# Altium project ESP32 with cam_OV5640_v2.PrjPcb
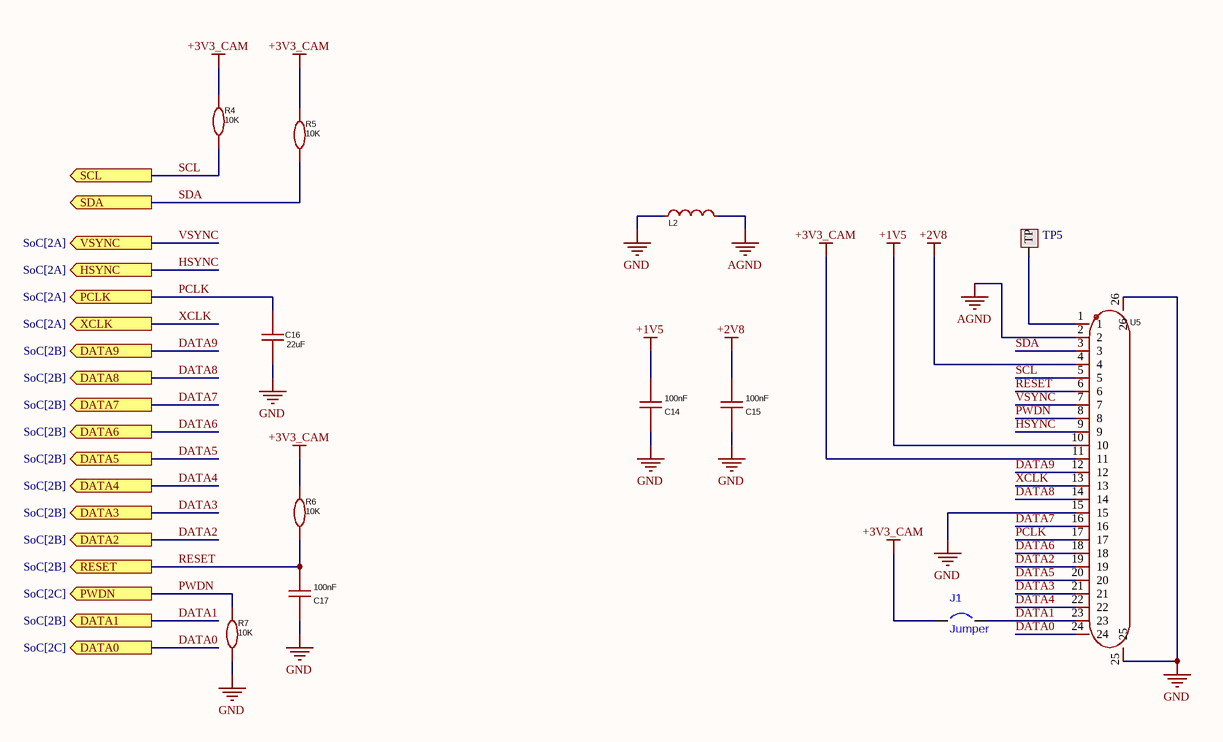
[diagram p0: Camera.SchDoc]
4 sheets, 53 parts. Net scope: flat (ports and power ports of the same name join across sheets).
Board file: ESP32 wth OV5640 CAM.PcbDoc
Sheets:
  Camera.SchDoc
  Power Conversion.SchDoc
  Project Overview.SchDoc
  SoC.SchDoc

## Sheet Camera.SchDoc
size A4; SheetNumber: 1; SheetTotal: 4

### Parts
C14  100nF  [100nF SMD Ceramic 201]
C15  100nF  [100nF SMD Ceramic 201]
C16  22uF  [22uF SMD Ceramic 1210]
C17  100nF  [100nF SMD Ceramic 201]
J1  Jumper  [PAD-JUMPER-2]
L2  BLM15AG601SN1D  [Ferrite]  (value not drawn)
R4  10K  [10K SMD Ceramic 201]
R5  10K  [10K SMD Ceramic 201]
R6  10K  [10K SMD Ceramic 201]
R7  10K  [10K SMD Ceramic 201]
TP5  TEST POINT  [TESTPOINT]  (value not drawn)
U5  FPC-05FB-24PH20  [Camera Connector]  (value not drawn)

### Ports
DATA0 (out, see SoC[2C]), DATA1 (out, see SoC[2B]), DATA2 (out, see SoC[2B]), DATA3 (out, see SoC[2B]), DATA4 (out, see SoC[2B]), DATA5 (out, see SoC[2B]), DATA6 (out, see SoC[2B]), DATA7 (out, see SoC[2B]), DATA8 (out, see SoC[2B]), DATA9 (out, see SoC[2B]), HSYNC (out, see SoC[2A]), PCLK (out, see SoC[2A]), PWDN (out, see SoC[2C]), RESET (out, see SoC[2B]), SCL (out, see SoC[2A]), SDA (out, see SoC[2A]), VSYNC (out, see SoC[2A]), XCLK (out, see SoC[2A])

### Nets
+1V5: C14.2 U5.10
+2V8: C15.2 U5.4
+3V3_CAM: J1.1 R4.2 R5.2 R6.2 U5.11
AGND: L2.2 U5.2
GND: C14.1 C15.1 C16.1 C17.1 L2.1 R7.1 U5.15 U5.25 U5.26
DATA0: U5.24 ; port DATA0
DATA1: J1.2 U5.23 ; port DATA1
DATA2: U5.19 ; port DATA2
DATA3: U5.21 ; port DATA3
DATA4: U5.22 ; port DATA4
DATA5: U5.20 ; port DATA5
DATA6: U5.18 ; port DATA6
DATA7: U5.16 ; port DATA7
DATA8: U5.14 ; port DATA8
DATA9: U5.12 ; port DATA9
HSYNC: U5.9 ; port HSYNC
PCLK: C16.2 U5.17 ; port PCLK
PWDN: R7.2 U5.8 ; port PWDN
RESET: C17.2 R6.1 U5.6 ; port RESET
SCL: R4.1 U5.5 ; port SCL
SDA: R5.1 U5.3 ; port SDA
VSYNC: U5.7 ; port VSYNC
XCLK: U5.13 ; port XCLK
NetTP5_1: TP5.1(TP) U5.1

### Notes on the sheet
- Date:
- Rev. No.
- Page No.
- Schematic Name
- Designed By
- Omar Faruk Badhon
- Check(1) HW Eng.
- Check(2) SW Eng.
- Approval(1)
- Approval(2)
- Address
- Company
- Dept. Name
- R&D

### Library data of the parts
C14 C15 C17 = 100nF SMD Ceramic 201: 10V 100nF X5R ±10% 0201 Multilayer Ceramic Capacitors MLCC - SMD/SMT ROHS; Manufacturer: muRata(村田); Symbol: GRM033R61A104KE84D; Add into BOM: yes; Device: GRM033R61A104KE84D; LCSC Part Name: 100nF ±10% 10V; Supplier Part: C161466; Manufacturer Part: GRM033R61A104KE84D; Supplier Footprint: 0201; JLCPCB Part Class: Extended Part; Datasheet: https://atta.szlcsc.com/upload/public/pdf/source/20181011/C161466_67687620A192BB2B75972275444AF1E7.pdf; Supplier: LCSC; Convert to PCB: yes; Value: 100nF; Tolerance: ±10%
C16 = 22uF SMD Ceramic 1210: 10V 22uF X7R ±10% 1210 Multilayer Ceramic Capacitors MLCC - SMD/SMT ROHS; Manufacturer: KEMET(基美); Symbol: C1210C226K8RACAUTO; Add into BOM: yes; Device: C1210C226K8RACAUTO; LCSC Part Name: 22uF ±10% 10V; Supplier Part: C561843; Manufacturer Part: C1210C226K8RACAUTO; Supplier Footprint: 1210; JLCPCB Part Class: Extended Part; Datasheet: https://atta.szlcsc.com/upload/public/pdf/source/20200618/C561824_5D581F10239D32C68F7958F74E29471B.pdf; Supplier: LCSC; Convert to PCB: yes; Value: 22uF; Tolerance: ±10%
J1 = JUMPER SOLDER BRIDGE: SMD JUMPER
L2 = BLM15AG601SN1D: 520mΩ ±25% 600Ω@100MHz 0402 Ferrite Beads ROHS; Manufacturer: muRata(村田); Add into BOM: yes; Current Rating: 300mA; Circuits: 1; Symbol: BLM15AG601SN1D; Device: BLM15AG601SN1D; LCSC Part Name: 单路 0402磁珠 阻抗600Ω@100MHz; Supplier Part: C76884; Manufacturer Part: BLM15AG601SN1D; Supplier Footprint: 0402; JLCPCB Part Class: Extended Part; Datasheet: https://atta.szlcsc.com/upload/public/pdf/source/20181120/C333978_3E581FB55966932B05020139ABDE8E01.pdf; Supplier: LCSC; Convert to PCB: yes; Impedance @ Frequency: 600Ω@100MHz; Tolerance: ±25%; DC Resistance: 520mΩ
R4-R7 = 10K SMD Ceramic 201: 50mW Thick Film Resistors 25V ±1% ±200ppm/℃ 10kΩ 0201 Chip Resistor - Surface Mount ROHS; Manufacturer: YAGEO(国巨); Symbol: AF0201FR-0710KL; Add into BOM: yes; Device: AF0201FR-0710KL; LCSC Part Name: 厚膜电阻 10kΩ ±1% 50mW; Supplier Part: C143978; Manufacturer Part: AF0201FR-0710KL; Supplier Footprint: 0201; JLCPCB Part Class: Extended Part; Datasheet: https://atta.szlcsc.com/upload/public/pdf/source/20180927/C229861_4ABDC471507C1ED6AFB4BA66AFC8620A.pdf; Supplier: LCSC; Convert to PCB: yes; Type: Thick Film Resistors; Value: 10kΩ; Tolerance: ±1%; Temperature Coefficient: ±200ppm/℃; Operating Temperature Range: -55℃~+125℃
U5 = Camera Connector: Dual-sided contacts / top and bottom connection -25℃~+85℃ Flip type 0.5mm Horizontal attachment 24P SMD; Manufacturer: XUNPU(讯普); Add into BOM: yes; Locking Feature: Clamshell; FFC, FCB Thickness: 0.3mm; Symbol: FPC-05FB-24PH20; Device: FPC-05FB-24PH20; LCSC Part Name: 间距:0.5mm P数:24P 翻盖式 双侧触点/上下接; Supplier Part: C2856831; Manufacturer Part: FPC-05FB-24PH20; Supplier Footprint: SMD,P=0.5mm,卧贴; JLCPCB Part Class: Extended Part; Datasheet: https://atta.szlcsc.com/upload/public/pdf/source/20210922/C2856831_717985F95873A81D5C0B7E3F2E5E5327.pdf; Supplier: LCSC; Convert to PCB: yes; Contact Type: Double-sided contacts/up and down connection; Number of Contacts: 24P; Pitch: 0.5mm; Mounting Type: 卧贴; Height Above Board: 2mm; Operating Temperature Range: -25℃~+85℃

## Sheet Power Conversion.SchDoc
size A4; SheetNumber: 2; SheetTotal: 4
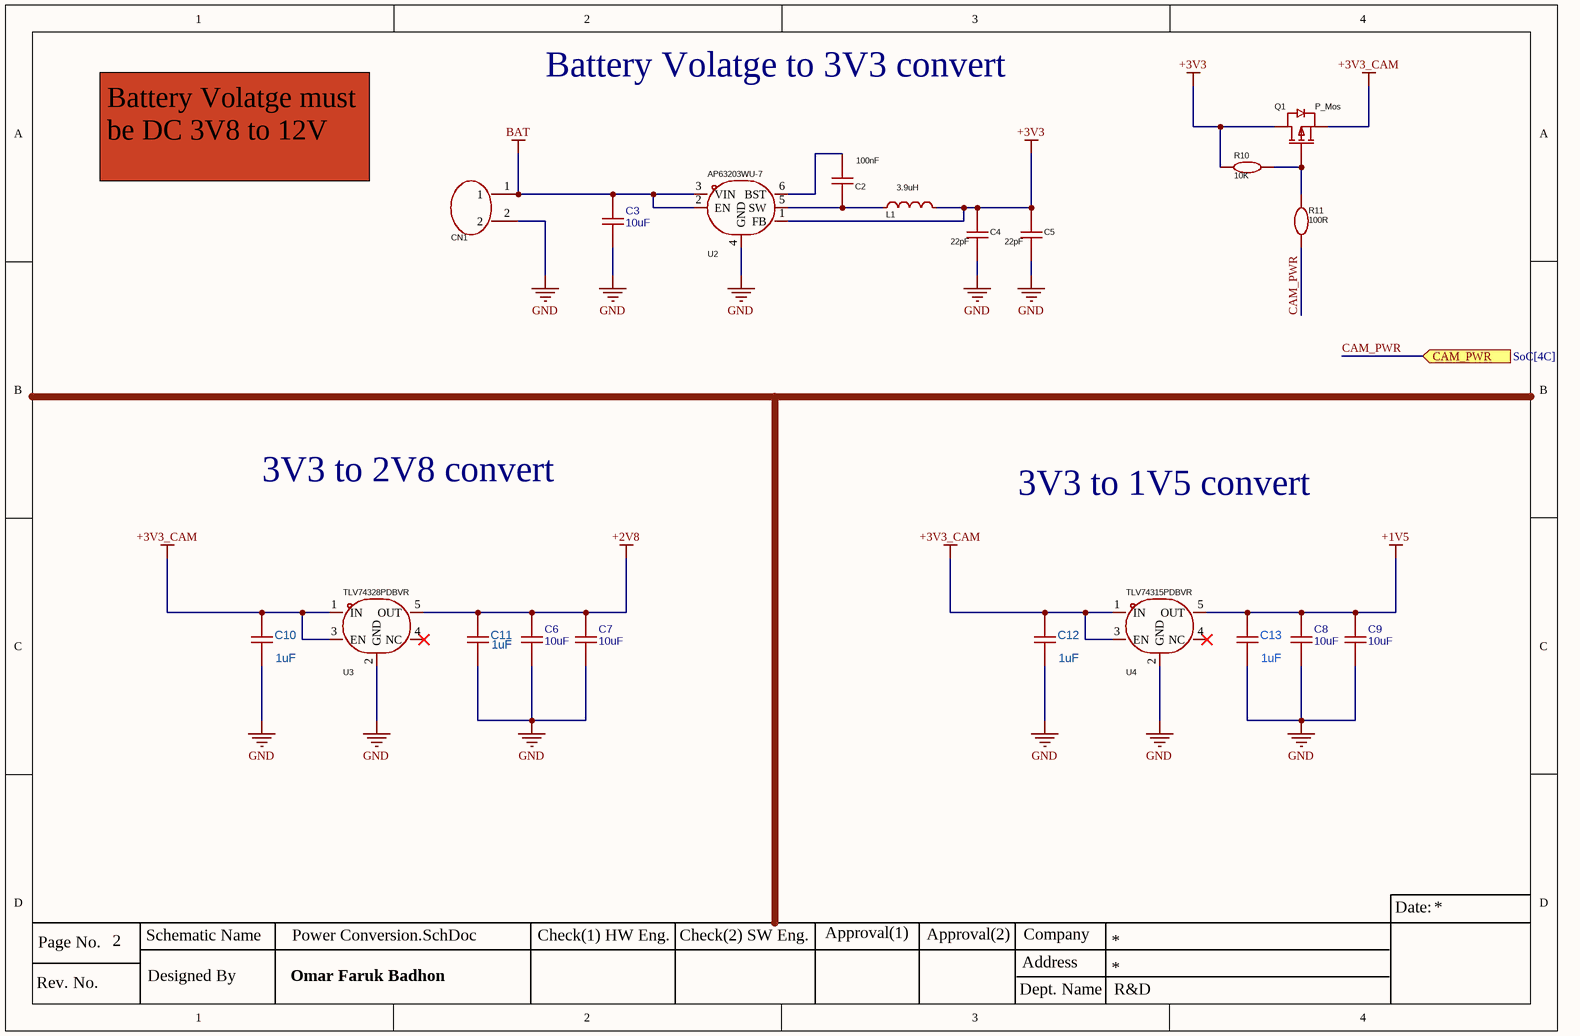
[diagram p1: Power Conversion.SchDoc]

### Parts
C2  100nF  [100nF SMD Ceramic 201]
C3  10uF  [10uF SMD Ceramic 603]
C4  22pF  [22pF SMD Ceramic 603]
C5  22pF  [22pF SMD Ceramic 603]
C6  10uF  [10uF SMD Ceramic 603]
C7  10uF  [10uF SMD Ceramic 603]
C8  10uF  [10uF SMD Ceramic 603]
C9  10uF  [10uF SMD Ceramic 603]
C10  1uF  [1uF Cap]
C11  1uF  [1uF Cap]
C12  1uF  [1uF Cap]
C13  1uF  [1uF Cap]
CN1  B2B-PH-K-S(LF)(SN)  [Connector 2P]  (value not drawn)
L1  3.9uH  [3.9uH power Inductor]
Q1  P_Mos  [P channel msfet (AO3401A1)]
R10  10K  [10K SMD Ceramic 201]
R11  100R  [100R 402]
U2  AP63203WU-7  [3V3 Converter (AP63203)]
U3  TLV74328PDBVR  [2V8 Converter (TLV74328)]
U4  TLV74315PDBVR  [1V5 Converter (TLV74215)]

### Ports
CAM_PWR (in, see SoC[4C])

### Nets
+1V5: C8.2 C9.2 C13.2 U4.5(OUT)
+2V8: C6.2 C7.2 C11.2 U3.5(OUT)
+3V3: C4.2 C5.2 L1.2 Q1.3(D) R10.1 U2.1(FB)
+3V3_CAM: C10.2 C12.2 Q1.2(S) U3.1(IN) U3.3(EN) U4.1(IN) U4.3(EN)
BAT: C3.2 CN1.1 U2.2(EN) U2.3(VIN)
GND: C3.1 C4.1 C5.1 C6.1 C7.1 C8.1 C9.1 C10.1 C11.1 C12.1 C13.1 CN1.2 U2.4(GND) U3.2(GND) U4.2(GND)
CAM_PWR: R11.1 ; port CAM_PWR
NetC2_1: C2.1 L1.1 U2.5(SW)
NetC2_2: C2.2 U2.6(BST)
NetQ1_1: Q1.1(G) R10.2 R11.2

Not connected (* = marked no-connect by the designer): U3 4(NC)*; U4 4(NC)*

### Notes on the sheet
- Battery Volatge to 3V3 convert
- Battery Volatge must be DC 3V8 to 12V
- 3V3 to 2V8 convert
- 3V3 to 1V5 convert
- Date:
- Rev. No.
- Page No.
- Schematic Name
- Designed By
- Omar Faruk Badhon
- Check(1) HW Eng.
- Check(2) SW Eng.
- Approval(1)
- Approval(2)
- Address
- Company
- Dept. Name
- R&D

### Library data of the parts
C2 = 100nF SMD Ceramic 201: as C14 on sheet Camera; Device: GRM033R61A104KE84D; LCSC Part Name: 100nF ±10% 10V; Supplier Part: C161466; Manufacturer Part: GRM033R61A104KE84D; Supplier Footprint: 0201; JLCPCB Part Class: Extended Part; Datasheet: https://atta.szlcsc.com/upload/public/pdf/source/20181011/C161466_67687620A192BB2B75972275444AF1E7.pdf; Supplier: LCSC; Convert to PCB: yes; Value: 100nF; Tolerance: ±10%
C3 C6-C9 = 10uF SMD Ceramic 603: 10V 10uF B ±10% 0603 Multilayer Ceramic Capacitors MLCC - SMD/SMT ROHS; Manufacturer: muRata(村田); Manufacturer Part: GRM188B31A106KE69D; nameAlias: Value; Contributor: LCSC; Supplier: LCSC; Supplier Part: C469532; JLCPCB Part Class: Extended Part; spicePre: C; spiceSymbolName: GRM188B31A106KE69D
C4 C5 = 22pF SMD Ceramic 603: 16V 22pF C0G ±5% 0603 Multilayer Ceramic Capacitors MLCC - SMD/SMT ROHS; Manufacturer: KEMET(基美); Symbol: C0603C220J4GAC7867; Add into BOM: yes; Device: C0603C220J4GAC7867; LCSC Part Name: 22pF ±5% 16V; Supplier Part: C561800; Manufacturer Part: C0603C220J4GAC7867; Supplier Footprint: 0603; JLCPCB Part Class: Extended Part; Datasheet: https://atta.szlcsc.com/upload/public/pdf/source/20200618/C561800_1756A88345AB30E1FCE50DFDDC46141D.pdf; Supplier: LCSC; Convert to PCB: yes; Value: 22pF; Tolerance: ±5%
C10-C13 = 1uF Ceramic SMD 603: 16V 1uF Y5V -20%~+80% 0603 Multilayer Ceramic Capacitors MLCC - SMD/SMT ROHS; Manufacturer: SAMWHA(三和); Symbol: CS1608Y5V105Z160NRB; Add into BOM: yes; Device: CS1608Y5V105Z160NRB; LCSC Part Name: 1uF -20%~+80% 16V; Supplier Part: C5189821; Manufacturer Part: CS1608Y5V105Z160NRB; Supplier Footprint: 0603; JLCPCB Part Class: Extended Part; Datasheet: https://atta.szlcsc.com/upload/public/pdf/source/20221012/139B9393213A50C271C48844AD3DF211.pdf; Supplier: LCSC; Convert to PCB: yes; Value: 1uF; Tolerance: -20%~+80%
CN1 = Connector 2P: 1x2P 2P PH Tin 2 -25℃~+85℃ 2A 1 2mm Brass Direct Insert Plugin,P=2mm Wire To Board Connector ROHS; Manufacturer: JST; Add into BOM: yes; Number of PINs Per Row: 2; Rated Voltage (Max): 100V; Plastic Material: PA66; Flame Retardant Rating: UL94V-0; Supplementary Features: K-leg punch; Z-Height of the Board: 6mm; X-Length of Bottom Edge on Board (Spacing Line): 5.9mm; Y-Width of Bottom Edge on Board: 4.5mm; Symbol: B2B-PH-K-S(LF)(SN); Device: B2B-PH-K-S(LF)(SN); LCSC Part Name: 1x2P 间距:2mm 直插 系列:PH; Supplier Part: C131337; Manufacturer Part: B2B-PH-K-S(LF)(SN); Supplier Footprint: 插件,P=2mm; JLCPCB Part Class: Extended Part; Datasheet: https://atta.szlcsc.com/upload/public/pdf/source/20171026/C131342_15089839687311058815.pdf; Supplier: LCSC; Convert to PCB: yes; Pins Structure: 1x2P; Pitch: 2mm; Mounting Style: Direct Insert; Reference Series: PH; Number of Pins: 2P; Number of Rows: 1; Row Spacing: -; Current Rating (Max): 2A; Contact Material: Brass; Contact Plating: Tin; Operating Temperature Range: -25℃~+85℃; Colour: White
L1 = 3.9uH SMD PI: 1.5A 3.9uH ±20% 1.4A SMD,3x3mm Power Inductors ROHS; Manufacturer: cjiang(长江微电); Symbol: FNR3015S3R9MT; Add into BOM: yes; DC Resistance (DCR): 137mΩ; Device: FNR3015S3R9MT; LCSC Part Name: 3.9uH ±20% 1.4A; Supplier Part: C167751; Manufacturer Part: FNR3015S3R9MT; Supplier Footprint: SMD,3x3mm; JLCPCB Part Class: Extended Part; Datasheet: https://atta.szlcsc.com/upload/public/pdf/source/20190327/C167925_9EFF0AABC4CA629C2CC95961DBF7D39D.pdf; Supplier: LCSC; Convert to PCB: yes; Value: 3.9uH; Tolerance: ±20%; Saturation Current (Isat): 1.4A
Q1 = P channel msfet (AO3401A1): 30V 4A 44mΩ@10V,4.3A 1.4W 1.3V@250uA 1 Piece P-Channel SOT-23 MOSFETs ROHS; Manufacturer: AOS; Device: AO3401A_C15127; Add into BOM: yes; Type: 1个PChannel; Total Gate Charge (Qg@Vgs): 12.2nC@4.5V; Input Capacitance (Ciss@Vds): 1.2nF@15V; Symbol: AO3401A; LCSC Part Name: 1个P沟道 耐压:30V 电流:4A; Supplier Part: C15127; Manufacturer Part: AO3401A; Supplier Footprint: SOT-23; JLCPCB Part Class: Basic Part; Datasheet: https://atta.szlcsc.com/upload/public/pdf/source/20160507/1462613609053.pdf; Supplier: LCSC; Convert to PCB: yes; Drain Source On Resistance (RDS(on)@Vgs,Id): 44mΩ@10V,4.3A; Gate Threshold Voltage (Vgs(th)@Id): 1.3V@250uA; Operating Temperature: -55℃~+150℃@(Tj)
R10 = 10K SMD Ceramic 201: as R4 on sheet Camera; Device: AF0201FR-0710KL; LCSC Part Name: 厚膜电阻 10kΩ ±1% 50mW; Supplier Part: C143978; Manufacturer Part: AF0201FR-0710KL; Supplier Footprint: 0201; JLCPCB Part Class: Extended Part; Datasheet: https://atta.szlcsc.com/upload/public/pdf/source/20180927/C229861_4ABDC471507C1ED6AFB4BA66AFC8620A.pdf; Supplier: LCSC; Convert to PCB: yes; Type: Thick Film Resistors; Value: 10kΩ; Tolerance: ±1%; Temperature Coefficient: ±200ppm/℃; Operating Temperature Range: -55℃~+125℃
R11 = 100R 402: 100mW Thick Film Resistors ±100ppm/℃ ±1% 100Ω 0402 Chip Resistor - Surface Mount ROHS; Manufacturer: PANASONIC(松下); Symbol: ERJ2RKF1000X; Add into BOM: yes; Device: ERJ2RKF1000X; LCSC Part Name: 100Ω ±1% 100mW 厚膜电阻; Supplier Part: C413063; Manufacturer Part: ERJ2RKF1000X; Supplier Footprint: 0402; JLCPCB Part Class: Extended Part; Datasheet: https://atta.szlcsc.com/upload/public/pdf/source/20190820/C413063_95D61CC78C57CA6EC5636452389D6E3B.pdf; Supplier: LCSC; Convert to PCB: yes; Type: Thick Film Resistors; Value: 100Ω; Tolerance: ±1%; Overload Voltage (Max): -; Temperature Coefficient: ±100ppm/℃; Operating Temperature Range: -55℃~+155℃
U2 = AP63203: Step-down type Fixed 2A 3.3V 3.8V~32V TSOT-23-6 DC-DC Converters ROHS; Manufacturer: DIODES(美台); Add into BOM: yes; Switching Frequency: 1.1MHz; Number of Outputs: 1; Switch tube (built-in/external): 内置; Symbol: AP63203WU-7; Device: AP63203WU-7; LCSC Part Name: AP63203WU-7; Supplier Part: C780769; Manufacturer Part: AP63203WU-7; Supplier Footprint: TSOT-23-6; JLCPCB Part Class: Extended Part; Datasheet: https://atta.szlcsc.com/upload/public/pdf/source/20210622/C780769_099C67289BD3EC61AAFB52D8B07125B3.pdf; Supplier: LCSC; Convert to PCB: yes; Function: Step-down type; Output Type: Fixed; Input Voltage: 3.8V~32V; Output Voltage: 3.3V; Output Current (Max): 2A; Operating Temperature: -40℃~+85℃@(TA); Synchronous Rectification: Yes; Topology: Step-down
U3 = TLV74328: 300mA 68dB Fixed 2.8V Positive electrode 5.5V SOT-23-5 Voltage Regulators - Linear, Low Drop Out (LDO) Regulators ROHS; Manufacturer: TI(德州仪器); Add into BOM: yes; Dropout Voltage: 290mV@(300mA); standby current: 60uA; Number of Outputs: 1; Symbol: TLV74328PDBVR; Device: TLV74328PDBVR; LCSC Part Name: 具有使能功能的 300mA、低 IQ、低压降稳压器; Supplier Part: C408971; Manufacturer Part: TLV74328PDBVR; Supplier Footprint: SOT-23-5; JLCPCB Part Class: Extended Part; Datasheet: https://www.ti.com/cn/lit/gpn/tlv743p; Supplier: LCSC; Convert to PCB: yes; Output Type: Fixed; Maximum Input Voltage: 5.5V; Output Voltage: 2.8V; Output Current: 300mA; Power Supply Rejection Ratio (PSRR): 68dB; Feature: 防静电保护；低ESR；Thermal Protection(TSD)；欠压闭锁；Overcurrent Protection(OCP)；带使能; Operating Temperature: -40℃~+125℃@(Tj); Output Polarity: Positive electrode
U4 = TLV74315: 300mA Fixed 1.5V Positive electrode 5.5V SOT-23-5 Voltage Regulators - Linear, Low Drop Out (LDO) Regulators ROHS; Manufacturer: TI(德州仪器); Add into BOM: yes; Dropout Voltage: 400mV@(300mA); standby current: 60uA; Number of Outputs: 1; Symbol: TLV74315PDBVR; Device: TLV74315PDBVR; LCSC Part Name: 具有使能功能的 300mA、低 IQ、低压降稳压器; Supplier Part: C469895; Manufacturer Part: TLV74315PDBVR; Supplier Footprint: SOT-23-5; JLCPCB Part Class: Extended Part; Datasheet: https://www.ti.com/cn/lit/gpn/tlv743p; Supplier: LCSC; Convert to PCB: yes; Output Type: Fixed; Maximum Input Voltage: 5.5V; Output Voltage: 1.5V; Output Current: 300mA; Feature: 防静电保护；Short-Circuit  Protection；低ESR；Thermal Protection(TSD)；欠压闭锁；Overcurrent Protection(OCP)；带使能; Operating Temperature: -40℃~+125℃@(Tj); Output Polarity: Positive electrode

## Sheet Project Overview.SchDoc
size A4; SheetNumber: 1; SheetTotal: 4

### Notes on the sheet
- Date:
- Rev. No.
- Page No.
- Schematic Name
- Designed By
- Omar Faruk Badhon
- Check(1) HW Eng.
- Check(2) SW Eng.
- Approval(1)
- Approval(2)
- Address
- Company
- Dept. Name
- R&D

## Sheet SoC.SchDoc
size A4; SheetNumber: 4; SheetTotal: 4
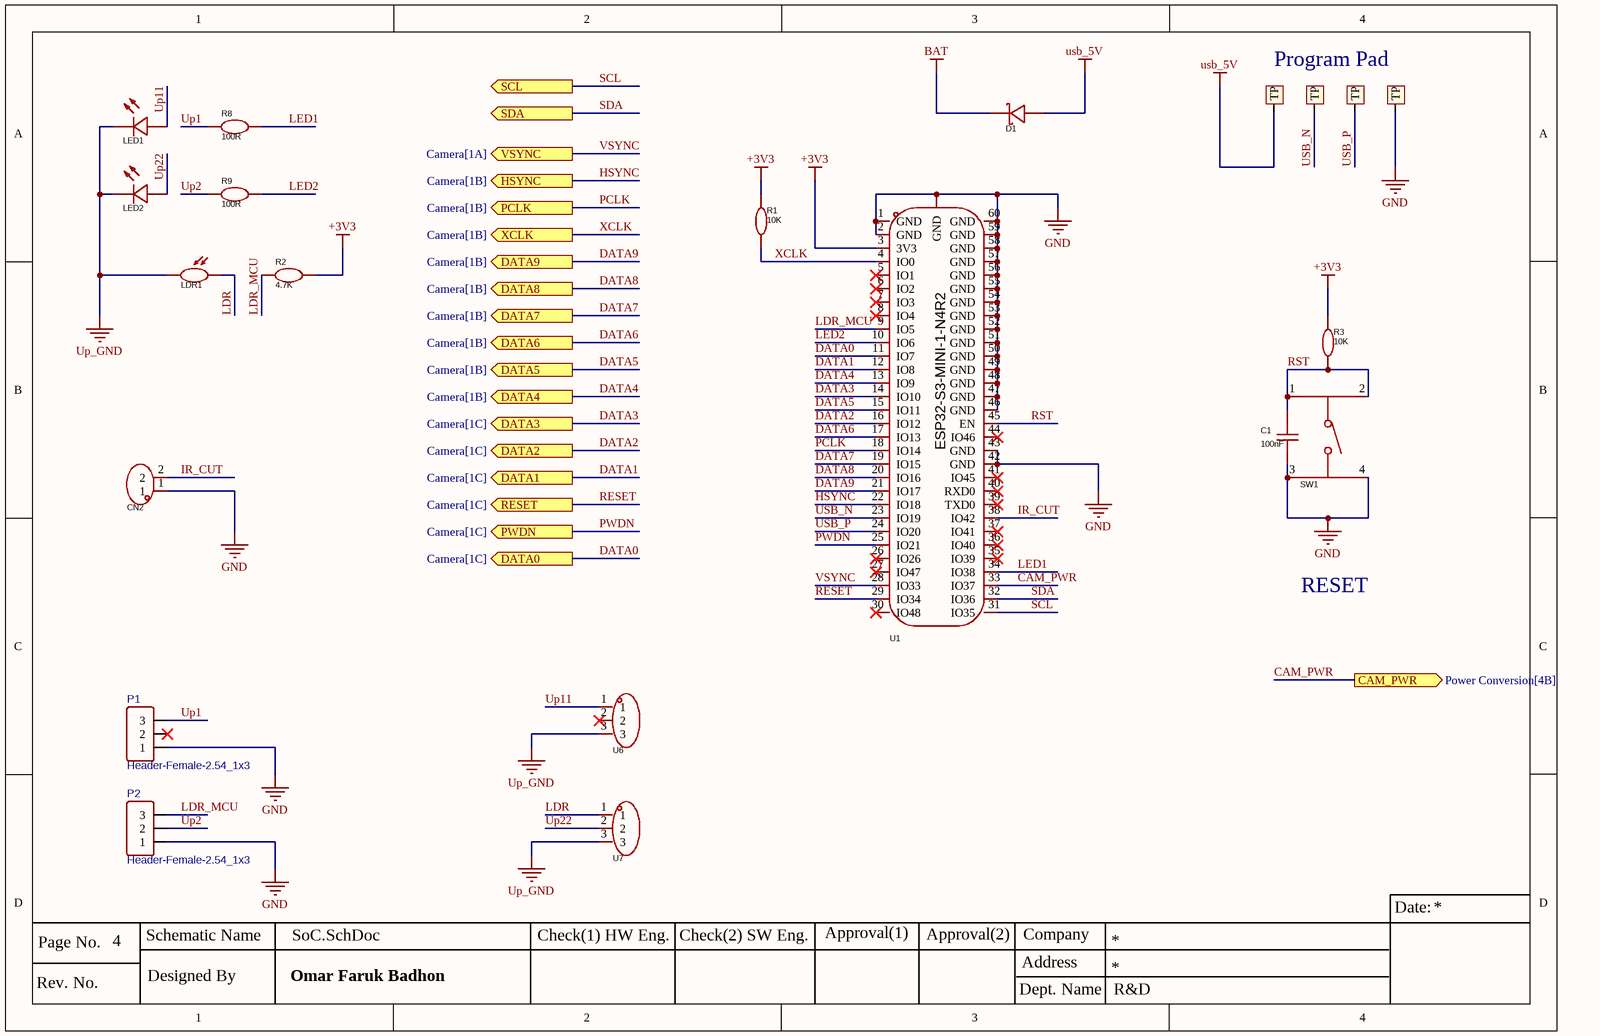
[diagram p2: SoC.SchDoc]

### Parts
C1  100nF  [100nF SMD Ceramic 201]
CN2  HDGC1501WV-2P  [2P white Connector 1.5mm]  (value not drawn)
D1  MBR120VLSFT1G  [Schottky Diode]  (value not drawn)
LDR1  GT36528  [LDR]  (value not drawn)
LED1  XYC-IRC18C-24  [LED SMD]  (value not drawn)
LED2  XYC-IRC18C-24  [LED SMD]  (value not drawn)
P1  Header-Female-2.54_1x3  [3P FH 2.54mm]
P2  Header-Female-2.54_1x3  [3P FH 2.54mm]
R1  10K  [10K SMD Ceramic 201]
R2  4.7K  [4k7 SMD 201]
R3  10K  [10K SMD Ceramic 201]
R8  100R  [100R 402]
R9  100R  [100R 402]
SW1  TS-1102-5516  [Push Button 4P]  (value not drawn)
TP1  TEST POINT  [TESTPOINT]  (value not drawn)
TP2  TEST POINT  [TESTPOINT]  (value not drawn)
TP3  TEST POINT  [TESTPOINT]  (value not drawn)
TP4  TEST POINT  [TESTPOINT]  (value not drawn)
U1  ESP32-S3-MINI-1-N4R2  [ESP32-S3-MINI-1-N8]
U6  HB-PH3-25413PB2GOP  [3P MH 2.54mm]  (value not drawn)
U7  HB-PH3-25413PB2GOP  [3P MH 2.54mm]  (value not drawn)

### Ports
CAM_PWR (out, see Power Conversion[4B]), DATA0 (out, see Camera[1C]), DATA1 (out, see Camera[1C]), DATA2 (out, see Camera[1C]), DATA3 (out, see Camera[1C]), DATA4 (out, see Camera[1B]), DATA5 (out, see Camera[1B]), DATA6 (out, see Camera[1B]), DATA7 (out, see Camera[1B]), DATA8 (out, see Camera[1B]), DATA9 (out, see Camera[1B]), HSYNC (out, see Camera[1B]), PCLK (out, see Camera[1B]), PWDN (out, see Camera[1C]), RESET (out, see Camera[1C]), SCL (out, see Camera[1A]), SDA (out, see Camera[1A]), VSYNC (out, see Camera[1A]), XCLK (out, see Camera[1B])

### Nets
+3V3: R1.2 R2.1 R3.2 U1.3(3V3)
BAT: D1.1(K)
GND: C1.1 CN2.1 P1.1 P2.1 SW1.3 SW1.4 TP4.1(TP) U1.1(GND) U1.2(GND) U1.42(GND) U1.43(GND) U1.46(GND) U1.47(GND) U1.48(GND) U1.49(GND) U1.50(GND) U1.51(GND) U1.52(GND) U1.53(GND) U1.54(GND) U1.55(GND) U1.56(GND) U1.57(GND) U1.58(GND) U1.59(GND) U1.60(GND) U1.GND
Up_GND: LDR1.1 LED1.1(C) LED2.1(C) U6.3 U7.3
usb_5V: D1.2(A) TP1.1(TP)
CAM_PWR: U1.33(IO37) ; port CAM_PWR
DATA0: U1.11(IO7) ; port DATA0
DATA1: U1.12(IO8) ; port DATA1
DATA2: U1.16(IO12) ; port DATA2
DATA3: U1.14(IO10) ; port DATA3
DATA4: U1.13(IO9) ; port DATA4
DATA5: U1.15(IO11) ; port DATA5
DATA6: U1.17(IO13) ; port DATA6
DATA7: U1.19(IO15) ; port DATA7
DATA8: U1.20(IO16) ; port DATA8
DATA9: U1.21(IO17) ; port DATA9
HSYNC: U1.22(IO18) ; port HSYNC
IR_CUT: CN2.2 U1.38(IO42)
LDR: LDR1.2 U7.1
LDR_MCU: P2.3 R2.2 U1.9(IO5)
LED1: R8.2 U1.34(IO38)
LED2: R9.2 U1.10(IO6)
PCLK: U1.18(IO14) ; port PCLK
PWDN: U1.25(IO21) ; port PWDN
RESET: U1.29(IO34) ; port RESET
RST: C1.2 R3.1 SW1.1 SW1.2 U1.45(EN)
SCL: U1.31(IO35) ; port SCL
SDA: U1.32(IO36) ; port SDA
Up1: P1.3 R8.1
Up2: P2.2 R9.1
Up11: LED1.2(A) U6.1
Up22: LED2.2(A) U7.2
USB_N: TP2.1(TP) U1.23(IO19)
USB_P: TP3.1(TP) U1.24(IO20)
VSYNC: U1.28(IO33) ; port VSYNC
XCLK: R1.1 U1.4(IO0) ; port XCLK

Not connected (* = marked no-connect by the designer): P1 2*; U1 5(IO1)* 6(IO2)* 7(IO3)* 8(IO4)* 26(IO26)* 27(IO47)* 30(IO48)* 35(IO39)* 36(IO40)* 37(IO41)* 39(TXD0)* 40(RXD0)* 41(IO45)* 44(IO46)*; U6 2*

### Notes on the sheet
- Program Pad
- RESET
- Date:
- Rev. No.
- Page No.
- Schematic Name
- Designed By
- Omar Faruk Badhon
- Check(1) HW Eng.
- Check(2) SW Eng.
- Approval(1)
- Approval(2)
- Address
- Company
- Dept. Name
- R&D

### Library data of the parts
C1 = 100nF SMD Ceramic 201: as C14 on sheet Camera; Device: GRM033R61A104KE84D; LCSC Part Name: 100nF ±10% 10V; Supplier Part: C161466; Manufacturer Part: GRM033R61A104KE84D; Supplier Footprint: 0201; JLCPCB Part Class: Extended Part; Datasheet: https://atta.szlcsc.com/upload/public/pdf/source/20181011/C161466_67687620A192BB2B75972275444AF1E7.pdf; Supplier: LCSC; Convert to PCB: yes; Value: 100nF; Tolerance: ±10%
CN2 = 2P Connector 1.5mm: Manufacturer: HDGC(华德共创); Add into BOM: yes; Pins Structure: 1x2P; Pitch: 1.5mm; Reference Series: ZH; Number of PINs Per Row: 2; Current Rating (Max): 1A; Symbol: HDGC1501WV-2P; Device: HDGC1501WV-2P; LCSC Part Name: 1x2P 间距:1.5mm 直插 系列:ZH; Supplier Part: C5175212; Manufacturer Part: HDGC1501WV-2P; Supplier Footprint: 插件,P=1.5mm; JLCPCB Part Class: Extended Part; Datasheet: https://atta.szlcsc.com/upload/public/pdf/source/20220916/0E4647A3A85E9D7CFB69507DE86E8F95.pdf; Supplier: LCSC; Convert to PCB: yes; Mounting Style: Direct Insert; Number of Pins: 2P; Number of Rows: 1
D1 = Schottky Diode: 20V 300mV@1A 1A SOD-123FL Schottky Diodes ROHS; Manufacturer: onsemi(安森美); Add into BOM: yes; Reverse Leakage Current (Ir): 600uA@20V; Symbol: MBR120VLSFT1G; Device: MBR120VLSFT1G; LCSC Part Name: 电压:20V 电流:1A; Supplier Part: C223608; Manufacturer Part: MBR120VLSFT1G; Supplier Footprint: SOD-123FL; JLCPCB Part Class: Extended Part; Datasheet: https://atta.szlcsc.com/upload/public/pdf/source/20221020/29D26ECD33A75D76A8E47ED9553F3BCF.pdf; Supplier: LCSC; Convert to PCB: yes; Forward Voltage (Vf@If): 300mV@1A; Reverse Voltage (Vr): 20V; Average Rectified Current (Io): 1A
LDR1 = LDR: SMD,2.4x3.6mm Photoresistors ROHS; Manufacturer: JCHL(晶创和立); Add into BOM: yes; Symbol: GT36528; Device: GT36528; LCSC Part Name: GT36528; Supplier Part: C2904881; Manufacturer Part: GT36528; Supplier Footprint: SMD,2.4x3.6mm; JLCPCB Part Class: Extended Part; Datasheet: https://atta.szlcsc.com/upload/public/pdf/source/20211014/6AB64DE2EFA295B23F73ED070F69DE44.pdf; Supplier: LCSC; Convert to PCB: yes
LED1 LED2 = LED SMD: Manufacturer: NEWOPTO(鑫永诚光电); Add into BOM: yes; Vf - Forward Voltage: 1.4V~1.8V; Power Dissipation: 900mW; Wavelength: 940nm; Current - DC Forward (If): 500mA; Reverse Voltage: 5V; View Angle: 120°; Symbol: XYC-IRC18C-24; Device: XYC-IRC18C-24; LCSC Part Name: XYC-IRC18C-24; Supplier Part: C2988733; Manufacturer Part: XYC-IRC18C-24; Supplier Footprint: SMD3030; JLCPCB Part Class: Extended Part; Datasheet: https://atta.szlcsc.com/upload/public/pdf/source/20220415/AF6ACF3234B7CCBAD1FA94129DBDDB73.pdf; Supplier: LCSC; Convert to PCB: yes; Operating Temperature: -40℃~+85℃
P1 P2 = Header-Female-2.54_1x3: Manufacturer: BOOMELE(博穆精密); Manufacturer Part: 2.54-1*3P母; Supplier Part: C146243; Supplier: LCSC; JLCPCB Part Class: Extended Part; spicePre: P; spiceSymbolName: Header-Female-2.54_1x3
R1 R3 = 10K SMD Ceramic 201: as R4 on sheet Camera; Device: AF0201FR-0710KL; LCSC Part Name: 厚膜电阻 10kΩ ±1% 50mW; Supplier Part: C143978; Manufacturer Part: AF0201FR-0710KL; Supplier Footprint: 0201; JLCPCB Part Class: Extended Part; Datasheet: https://atta.szlcsc.com/upload/public/pdf/source/20180927/C229861_4ABDC471507C1ED6AFB4BA66AFC8620A.pdf; Supplier: LCSC; Convert to PCB: yes; Type: Thick Film Resistors; Value: 10kΩ; Tolerance: ±1%; Temperature Coefficient: ±200ppm/℃; Operating Temperature Range: -55℃~+125℃
R2 = 4K7 SMD 201: 50mW Thick Film Resistors 25V ±1% ±200ppm/℃ 4.7kΩ 0201 Chip Resistor - Surface Mount ROHS; Manufacturer: YAGEO(国巨); Symbol: AF0201FR-074K7L; Add into BOM: yes; Device: AF0201FR-074K7L; LCSC Part Name: 厚膜电阻 4.7kΩ ±1% 50mW; Supplier Part: C2105831; Manufacturer Part: AF0201FR-074K7L; Supplier Footprint: 0201; JLCPCB Part Class: Extended Part; Datasheet: https://atta.szlcsc.com/upload/public/pdf/source/20210712/C2105831_B7E5D2600BF229B29F1C9CE0CCE2B3D7.pdf; Supplier: LCSC; Convert to PCB: yes; Type: Thick Film Resistors; Value: 4.7kΩ; Tolerance: ±1%; Temperature Coefficient: ±200ppm/℃; Operating Temperature Range: -55℃~+125℃
R8 R9 = 100R 402: as R11 on sheet Power Conversion; Device: ERJ2RKF1000X; LCSC Part Name: 100Ω ±1% 100mW 厚膜电阻; Supplier Part: C413063; Manufacturer Part: ERJ2RKF1000X; Supplier Footprint: 0402; JLCPCB Part Class: Extended Part; Datasheet: https://atta.szlcsc.com/upload/public/pdf/source/20190820/C413063_95D61CC78C57CA6EC5636452389D6E3B.pdf; Supplier: LCSC; Convert to PCB: yes; Type: Thick Film Resistors; Value: 100Ω; Tolerance: ±1%; Overload Voltage (Max): -; Temperature Coefficient: ±100ppm/℃; Operating Temperature Range: -55℃~+155℃
SW1 = Push Button 4P: 6mm 5.5mm Round Button 25mA Direct Insert 6mm SPST 100000 Times 1.6N 24V Plugin Tactile Switches ROHS; Manufacturer: SOFNG(硕方); Add into BOM: yes; Actuator/Cap Color: Black; Mechanical Life: 100000次; Symbol: TS-1102-5516; Device: TS-1102-5516; LCSC Part Name: 6*6*5.5mm 直插 轻触开关; Supplier Part: C183624; Manufacturer Part: TS-1102-5516; Supplier Footprint: 插件; JLCPCB Part Class: Extended Part; Datasheet: https://atta.szlcsc.com/upload/public/pdf/source/20200911/C111374_C70AFD1A656F1EADE52E4A6E5D3FC819.pdf; Supplier: LCSC; Convert to PCB: yes; Circuit: SPST; Actuator Style: Round Button; Operating Force: 1.6N; Mounting Style: Straight; Switch Length: 6mm; Switch Width: 6mm; Switch Height: 5.5mm; Contact Current: 25mA; Voltage Rating (DC): 24V; With Lamp: -; Operating Temperature: -40℃~+85℃
U1 = ESP32-S3-MINI-1-N4R2: Manufacturer: ESPRESSIF(乐鑫); Add into BOM: yes; Antenna Type: 板载PCBAntenna; Symbol: ESP32-S3-MINI-1-N4R2; Device: ESP32-S3-MINI-1-N4R2; LCSC Part Name: ESP32-S3-MINI-1-N4R2; Supplier Part: C3013941; Manufacturer Part: ESP32-S3-MINI-1-N4R2; Supplier Footprint: SMD; JLCPCB Part Class: Extended Part; Supplier: LCSC; Convert to PCB: yes
U6 U7 = 3P MH 2.54mm: Manufacturer: HANBO(汉博); Add into BOM: yes; Pin Structure: 1x3P; Pitch: 2.54mm; Circluar Pins/Square Pins: Square Pins; Current Rating (Max): 3A; Voltage Rating (Max): 250V; Soldering Temperature(Max): 260℃; Symbol: HB-PH3-25413PB2GOP; Device: HB-PH3-25413PB2GOP; LCSC Part Name: 间距:2.54mm 1x3P 直插 方针; Supplier Part: C6332196; Manufacturer Part: HB-PH3-25413PB2GOP; Supplier Footprint: 插件,P=2.54mm; JLCPCB Part Class: Extended Part; Datasheet: https://atta.szlcsc.com/upload/public/pdf/source/20230803/F72D259687963761DF1B552F3BB84A31.pdf; Supplier: LCSC; Convert to PCB: yes; Row Spacing: 2.54mm; Mounting Type: Straight; Number of Rows: Plugin; Number of Pins: 3P; Length of Mating Pin: 6mm; Insulation Height: 2.54mm; Length of End Connection Pin: 3mm; Contact Plating: Gold; Operating Temperature Range: -40℃~+105℃; Color: Black

## Nets that join several sheets
+1V5: Camera (C14.2 U5.10), Power Conversion (C8.2 C9.2 C13.2 U4.5)
+2V8: Camera (C15.2 U5.4), Power Conversion (C6.2 C7.2 C11.2 U3.5)
+3V3: Power Conversion (6 pins), SoC (R1.2 R2.1 R3.2 U1.3)
+3V3_CAM: Camera (5 pins), Power Conversion (7 pins)
BAT: Power Conversion (C3.2 CN1.1 U2.2 U2.3), SoC (D1.1)
GND: Camera (9 pins), Power Conversion (15 pins), SoC (27 pins)
CAM_PWR: Power Conversion (R11.1), SoC (U1.33)
DATA0: Camera (U5.24), SoC (U1.11)
DATA1: Camera (J1.2 U5.23), SoC (U1.12)
DATA2: Camera (U5.19), SoC (U1.16)
DATA3: Camera (U5.21), SoC (U1.14)
DATA4: Camera (U5.22), SoC (U1.13)
DATA5: Camera (U5.20), SoC (U1.15)
DATA6: Camera (U5.18), SoC (U1.17)
DATA7: Camera (U5.16), SoC (U1.19)
DATA8: Camera (U5.14), SoC (U1.20)
DATA9: Camera (U5.12), SoC (U1.21)
HSYNC: Camera (U5.9), SoC (U1.22)
PCLK: Camera (C16.2 U5.17), SoC (U1.18)
PWDN: Camera (R7.2 U5.8), SoC (U1.25)
RESET: Camera (C17.2 R6.1 U5.6), SoC (U1.29)
SCL: Camera (R4.1 U5.5), SoC (U1.31)
SDA: Camera (R5.1 U5.3), SoC (U1.32)
VSYNC: Camera (U5.7), SoC (U1.28)
XCLK: Camera (U5.13), SoC (R1.1 U1.4)